# EAGLE design tranz (EAGLE 7.1.0)
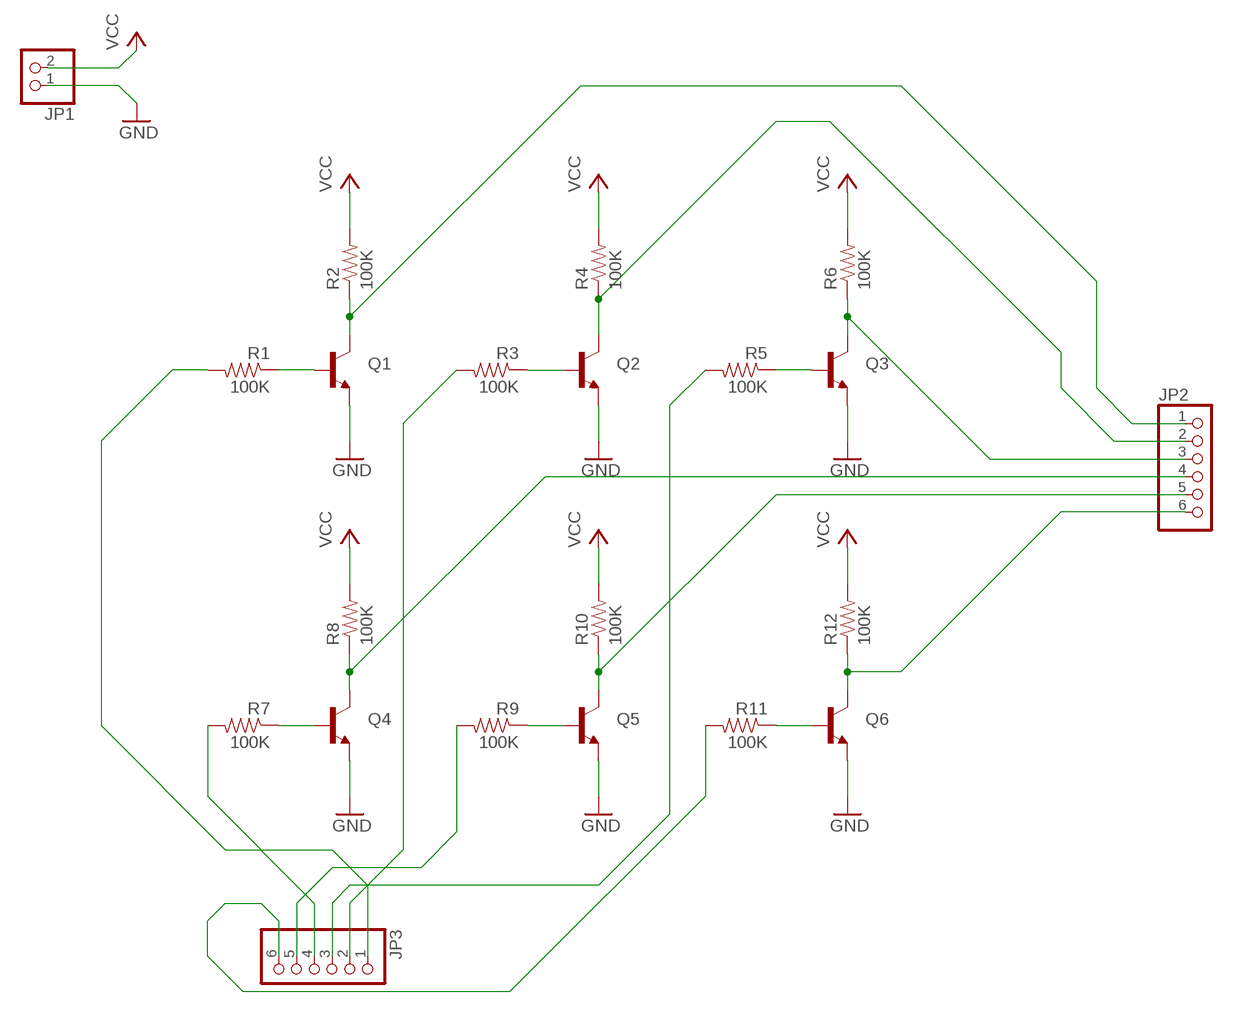
[diagram p0: schematic, sheet 1]

## Parts
JP1  PINHD-1X2  [1X02]
JP2  PINHD-1X6  [1X06]
JP3  PINHD-1X6  [1X06]
Q1  TRANSISTOR_NPN2N3904  [TO-92]
Q2  TRANSISTOR_NPN2N3904  [TO-92]
Q3  TRANSISTOR_NPN2N3904  [TO-92]
Q4  TRANSISTOR_NPN2N3904  [TO-92]
Q5  TRANSISTOR_NPN2N3904  [TO-92]
Q6  TRANSISTOR_NPN2N3904  [TO-92]
R1  100K  RESISTOR1206  [1206]
R2  100K  RESISTOR1206  [1206]
R3  100K  RESISTOR1206  [1206]
R4  100K  RESISTOR1206  [1206]
R5  100K  RESISTOR1206  [1206]
R6  100K  RESISTOR1206  [1206]
R7  100K  RESISTOR1206  [1206]
R8  100K  RESISTOR1206  [1206]
R9  100K  RESISTOR1206  [1206]
R10  100K  RESISTOR1206  [1206]
R11  100K  RESISTOR1206  [1206]
R12  100K  RESISTOR1206  [1206]

## Nets
GND: JP1.1 Q1.1(E) Q2.1(E) Q3.1(E) Q4.1(E) Q5.1(E) Q6.1(E)
N$1: JP3.1 R1.2
N$2: Q1.2(B) R1.1
N$3: JP3.2 R3.2
N$4: JP3.3 R5.2
N$5: JP3.4 R7.2
N$6: JP3.5 R9.2
N$7: JP3.6 R11.2
N$9: JP2.1 Q1.3(C) R2.1
N$10: JP2.2 Q2.3(C) R4.1
N$11: Q2.2(B) R3.1
N$12: JP2.3 Q3.3(C) R6.1
N$13: Q3.2(B) R5.1
N$14: JP2.6 Q6.3(C) R12.1
N$15: Q6.2(B) R11.1
N$16: Q4.2(B) R7.1
N$17: JP2.4 Q4.3(C) R8.1
N$18: JP2.5 Q5.3(C) R10.1
N$19: Q5.2(B) R9.1
VCC: JP1.2 R2.2 R4.2 R6.2 R8.2 R10.2 R12.2

## Library data of the parts
JP1 = pinhead:PINHD-1X2: PIN HEADER
JP2 JP3 = pinhead:PINHD-1X6: PIN HEADER
Q1-Q6 = SparkFun-DiscreteSemi:TRANSISTOR_NPN: Generic NPN BJT MMBT2222A - TRANS-08049 (SOT-23, 1A 40V) MPSA42 - TRANS-09116 (SOT-23, 500mA 300V) MMBT5088LT1G - TRANS-11160 (SOT-23, 50 mA 30V) BC547 - COM-08928 <http://www.sparkfun.com/products/8928> (TO-92 45V 100mA) (1.Collector 2.Base 3.Emitter) 2N3904 - COM-00521 <http://www.sparkfun.com/products/521> (TO-92 40V 200mA) (1.Emitter 2.Base 3.Collector) P2N2222A - COM-12852 <http://www.sparkfun.com/products/12852> (TO-92 40V 600mA) (1.Collector 2.Base 3.Emitter); PROD_ID: TRANS-08447
R1-R12 = SparkFun-Resistors:RESISTOR: Resistor Basic schematic elements and footprints for 0603, 1206, and PTH resistors.

## Board
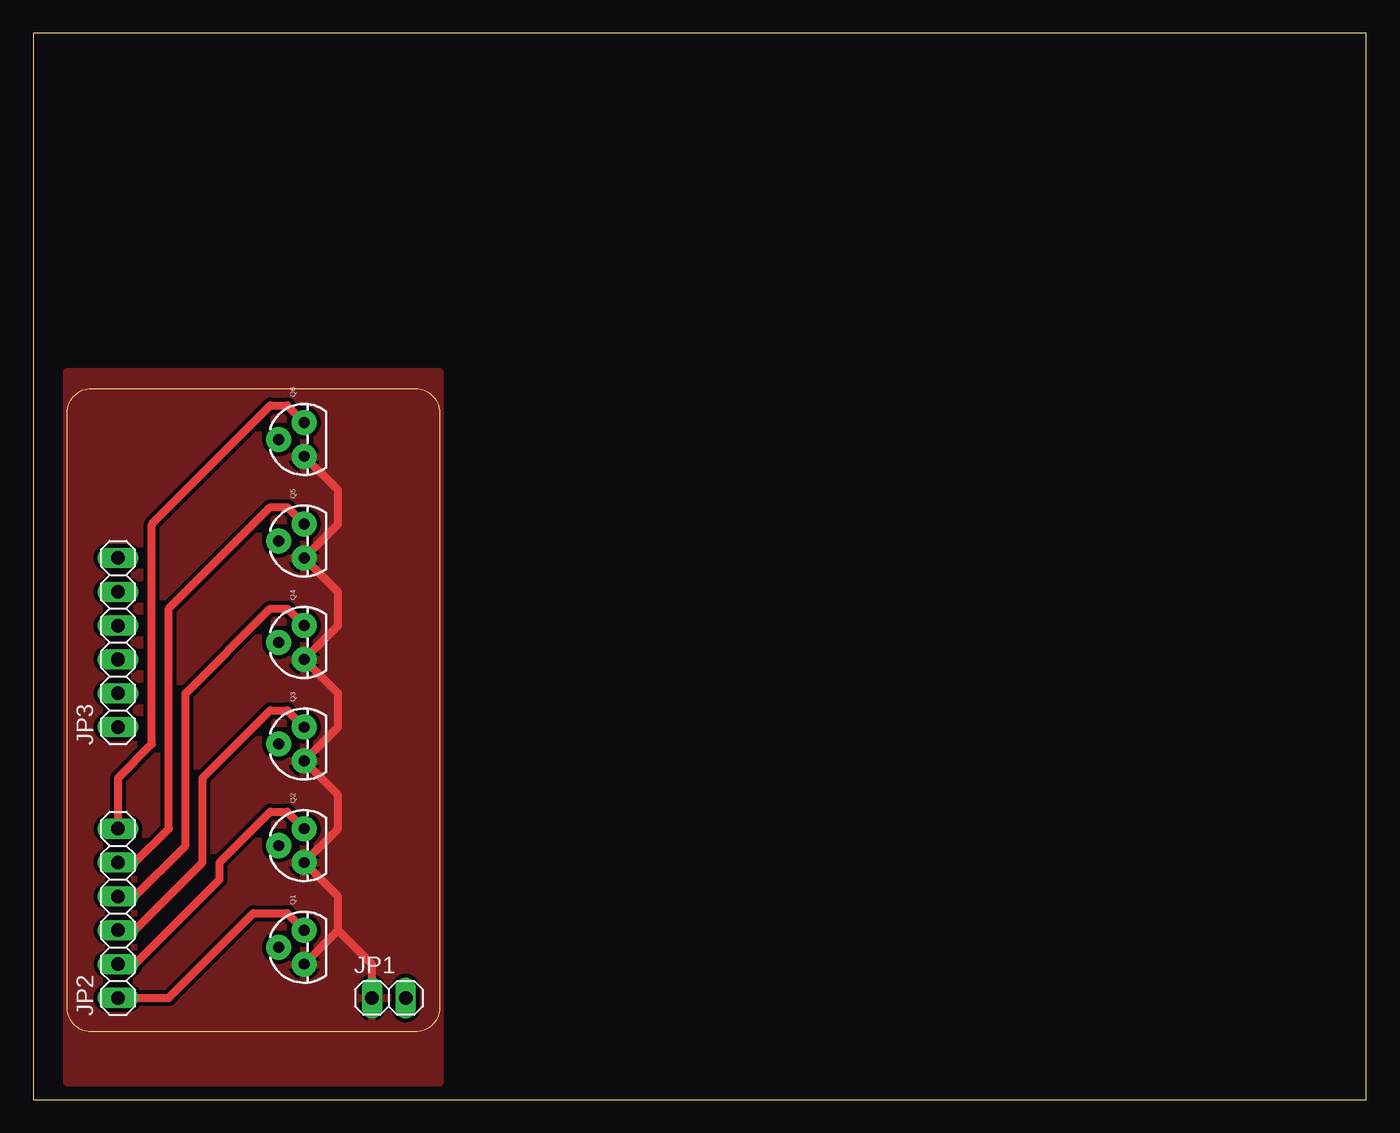
[diagram p1: board, top side]
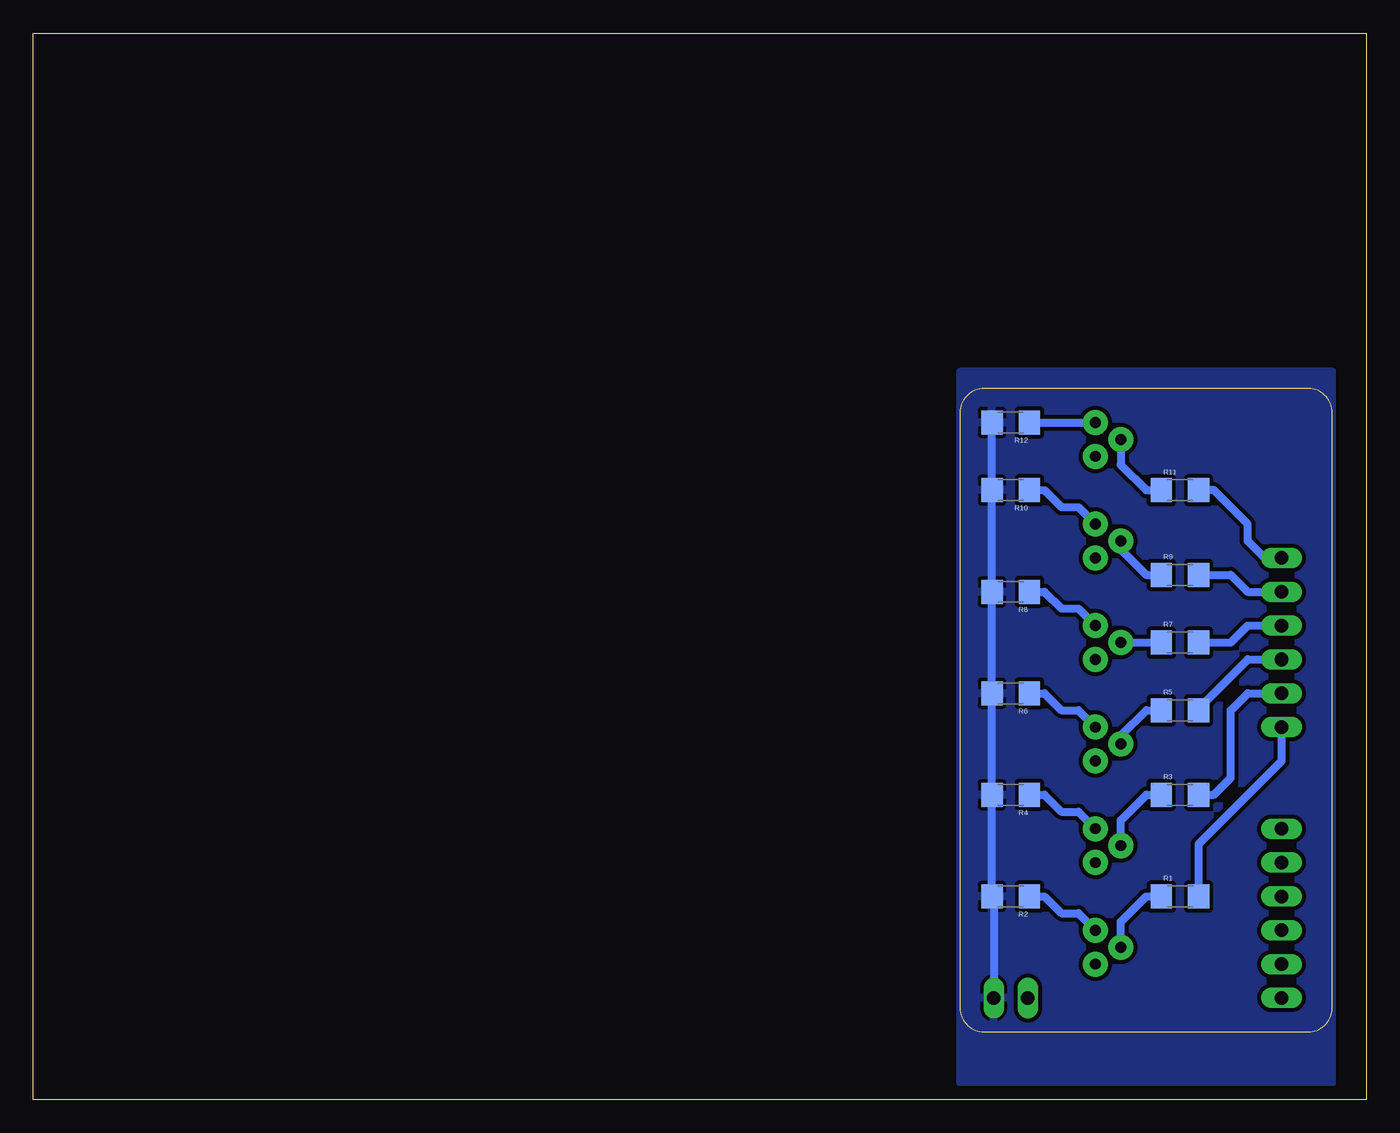
[diagram p2: board, bottom side, seen from below]

Size 100 x 80 mm. Coordinates in mm from the lower left corner, seen from the top.
Outline: 0,0 100,0 100,80 0,80 0,0
Copper layers (1*16): Top 0.035mm / dielectric 1.5mm / Bottom 0.035mm
Design rules "default *": minimum track width 10mil, minimum drill 24mil, track to track 0.3mm, track to pad 0.3mm, pad to pad 0.3mm, via to via 8mil, smd to smd 8mil, copper to edge 40mil, drill to drill 8mil, minimum pad ring 10mil, minimum via ring 8mil, stop-mask expansion 4mil, vias tented up to drill 0mil, thermal gap 10mil
Milling: 8 lines

### Footprints (pad centres in the part's own frame; a part is rotated, then mirrored left to right if it is on the bottom)
1X02 = drill 1.016 long: 1 -1.27,0; 2 1.27,0
1X06 = drill 1.016 long: 1 -6.35,0; 2 -3.81,0; 3 -1.27,0; 4 1.27,0; 5 3.81,0; 6 6.35,0
TO-92 = drill 0.813 pad 1.88: 1 -1.27,0; 2 0,1.905; 3 1.27,0
1206 = smd 1.6 x 1.8: 1 -1.4,0; 2 1.4,0

### Placement (x,y rotation side)
JP1  26.67,7.62 0 top
JP2  6.35,13.97 90 top
JP3  6.35,34.29 90 top
Q1  20.32,11.43 90 top
Q2  20.32,19.05 90 top
Q3  20.32,26.67 90 top
Q4  20.32,34.29 90 top
Q5  20.32,41.91 90 top
Q6  20.32,49.53 90 top
R1  13.97,15.24 0 bottom
R2  26.67,15.24 180 bottom
R3  13.97,22.86 0 bottom
R4  26.67,22.86 180 bottom
R5  13.97,29.21 0 bottom
R6  26.67,30.48 180 bottom
R7  13.97,34.29 0 bottom
R8  26.67,38.1 180 bottom
R9  13.97,39.37 0 bottom
R10  26.67,45.72 180 bottom
R11  13.97,45.72 0 bottom
R12  26.67,50.8 180 bottom

### Tracks (layer width: path | path; a pad name or v marks a point on that pad's centre or on a via)
GND
  Top 0.61: Q1.1 22.86,12.7 | 22.86,12.7 22.86,15.24 Q2.1 22.86,20.32 22.86,22.86 Q3.1 22.86,27.94 22.86,30.48 Q4.1 22.86,35.56 22.86,38.1 Q5.1 22.86,43.18 22.86,45.72 Q6.1 | JP1.1 25.4,10.16 22.86,12.7
  pour Top: 2.54,54.61 30.48,54.61 30.48,1.27 2.54,1.27
N$1
  Bottom 0.61: R1.2 12.57,19.18 6.35,25.4 JP3.1
N$2
  Bottom 0.61: Q1.2 18.41,13.34 16.51,15.24 R1.1
N$3
  Bottom 0.61: R3.2 11.43,22.86 10.16,24.13 10.16,29.21 8.89,30.48 JP3.2
N$4
  Bottom 0.61: R5.2 12.57,29.34 8.89,33.02 JP3.3
N$5
  Bottom 0.61: R7.2 10.16,34.29 8.89,35.56 JP3.4
N$6
  Bottom 0.61: R9.2 10.16,39.37 8.89,38.1 JP3.5
N$7
  Bottom 0.61: JP3.6 7.62,40.64 8.89,41.91 8.89,43.18 11.43,45.72 R11.2
N$8
  pour Top: 2.54,54.61 30.48,54.61 30.48,1.27 2.54,1.27
N$9
  Top 0.61: JP2.1 10.16,7.62 16.51,13.97 19.05,13.97 Q1.3
  Bottom 0.61: R2.1 24.13,15.24 22.86,13.97 21.59,13.97 Q1.3
N$10
  Top 0.61: JP2.2 7.62,10.16 13.97,16.51 13.97,17.78 17.78,21.59 19.05,21.59 Q2.3
  Bottom 0.61: R4.1 24.13,22.86 22.86,21.59 21.59,21.59 Q2.3
N$11
  Bottom 0.61: Q2.2 18.41,20.95 16.51,22.86 R3.1
N$12
  Top 0.61: JP2.3 7.62,12.7 12.7,17.78 12.7,24.13 17.78,29.21 19.05,29.21 Q3.3
  Bottom 0.61: R6.1 24.13,30.48 22.86,29.21 21.59,29.21 Q3.3
N$13
  Bottom 0.61: Q3.2 18.41,27.3 16.51,29.21 R5.1
N$14
  Top 0.61: JP2.6 6.35,24.13 8.89,26.67 8.89,43.18 17.78,52.07 19.05,52.07 Q6.3
  Bottom 0.61: R12.1 Q6.3
N$15
  Bottom 0.61: Q6.2 18.41,47.62 16.51,45.72 R11.1
N$16
  Bottom 0.61: Q4.2 R7.1
N$17
  Top 0.61: JP2.4 7.62,15.24 11.43,19.05 11.43,30.48 17.78,36.83 19.05,36.83 Q4.3
  Bottom 0.61: R8.1 24.13,38.1 22.86,36.83 21.59,36.83 Q4.3
N$18
  Top 0.61: JP2.5 7.62,17.78 10.16,20.32 10.16,36.83 17.78,44.45 19.05,44.45 Q5.3
  Bottom 0.61: R10.1 24.13,45.72 22.86,44.45 21.59,44.45 Q5.3
N$19
  Bottom 0.61: Q5.2 18.41,41.27 16.51,39.37 R9.1
N$20
  pour Bottom: 2.54,54.61 30.48,54.61 30.48,1.27 2.54,1.27
VCC
  Bottom 0.61: R12.2 R10.2 R8.2 R6.2 R4.2 R2.2 27.94,15.11 JP1.2
  pour Bottom: 2.54,54.61 30.48,54.61 30.48,1.27 2.54,1.27